# Altium schematic sheet Debug.SchDoc: DEBUG PORTS
size A4; SheetNumber: 7; SheetTotal: 7; DOC_NO_SCH_DWG: #022024031506
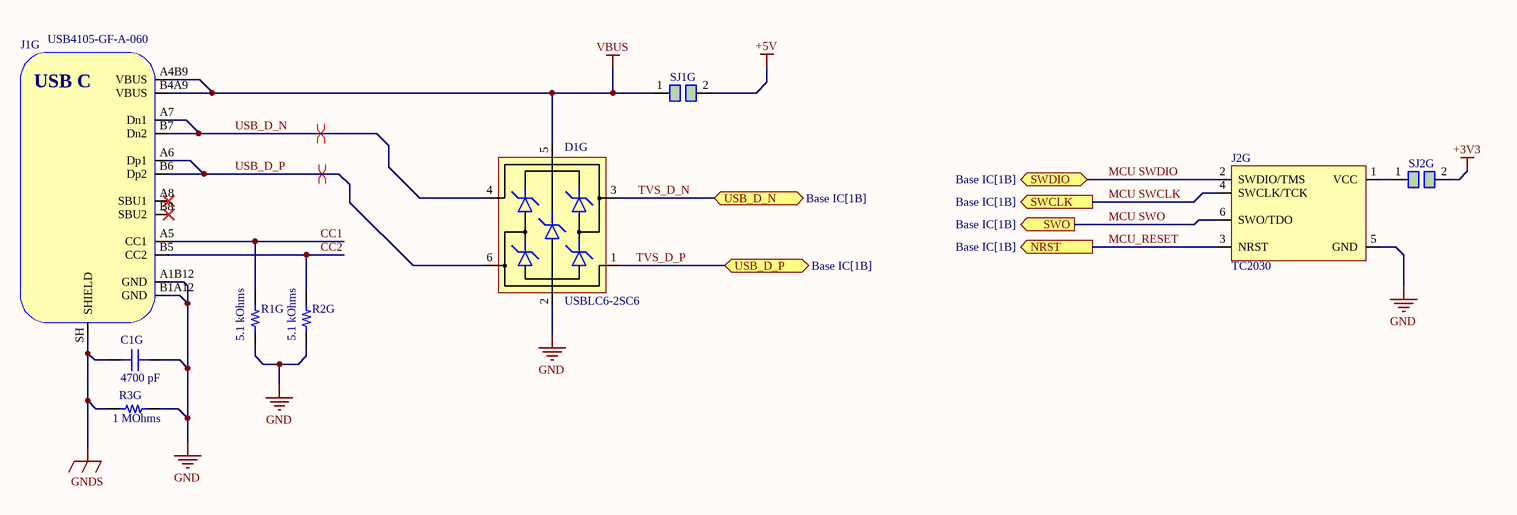
[diagram p0: Debug.SchDoc]

## Parts
C1G  4700 pF  [CAP 0402_1005]
D1G  USBLC6-2SC6  [SOT-23-6]
J1G  USB4105-GF-A-060  [USB4105-GF-A-060]
J2G  TC2030  [TC2030-FP]  (no BOM)
R1G  5.1 kOhms  [RES 0402_1005]
R2G  5.1 kOhms  [RES 0402_1005]
R3G  1 MOhms  [RES 0402_1005]
SJ1G  2PIN  [Rectangular Jumper]  (value not drawn)
SJ2G  2PIN  [Rectangular Jumper]  (value not drawn)

## Ports
NRST (out, see Base IC[1B]), SWCLK (out, see Base IC[1B]), SWDIO (bidir, see Base IC[1B]), SWO (out, see Base IC[1B]), USB_D_N (bidir, see Base IC[1B]), USB_D_P (bidir, see Base IC[1B])

## Nets
+3V3: SJ2G.2
+5V: SJ1G.2
GND: C1G.2 D1G.2(GND) J1G.A1B12(GND) J1G.B1A12(GND) J2G.5(GND) R1G.1 R2G.1 R3G.2
GNDS: C1G.1 J1G.SH(SHIELD) R3G.1
VBUS: D1G.5(VBUS) J1G.A4B9(VBUS) J1G.B4A9(VBUS) SJ1G.1
CC1: J1G.A5(CC1) R1G.2
CC2: J1G.B5(CC2) R2G.2
MCU SWCLK: J2G.4(SWCLK/TCK) ; port SWCLK
MCU SWDIO: J2G.2(SWDIO/TMS) ; port SWDIO
MCU SWO: J2G.6(SWO/TDO) ; port SWO
MCU_RESET: J2G.3(NRST) ; port NRST
TVS_D_N: D1G.3(IO2) ; port USB_D_N
TVS_D_P: D1G.1(IO1) ; port USB_D_P
USB_D_N: D1G.4(IO2) J1G.A7(Dn1) J1G.B7(Dn2)
USB_D_P: D1G.6(IO1) J1G.A6(Dp1) J1G.B6(Dp2)
NetJ2G_1: J2G.1(VCC) SJ2G.1

Not connected (* = marked no-connect by the designer): J1G A8(SBU1)* B8(SBU2)*

## Layout directives
differential pair: USB_D_N, USB_D_P

## Notes on the sheet
- THIS DOCUMENT AND THE DATA DISCLOSED HEREIN OR
- HEREWITH IS THE PROPERTY OF SPD Ind.
- ENG:
- DHARAGESWARAN S
- APPROVALS
- DATE
- PROJECT
- DSN:
- CHK:
- REFERENCE DOCUMENTS
- PROJECT REVISION:
- TITLE
- DOCUMENT REVISION:
- Email: sdhamuvkl@gmail.com <https://github.com/DhamuVkl>
- BOM:
- FAB DWG:
- PCB DWG:
- ASSY DWG:
- SCALE:
- A4
- SIZE
- CAGE CODE
- FILE NAME
- DWG NO.
- SHEET
- REV
- OF
- (in symbol USB4105-GF-A-060) USB C

## Library data of the parts
C1G = C0402C472K4RECAUTO: CAP CER 0402 4.7NF 16V X7R 10%; Manufacturer: KEMET; id: 3032; Part Number: C0402C472K4RECAUTO; Value: 4700 pF; Temperature Coefficient: X7R; Supplier Part Number 1: 399-17875-1-ND; ComponentLink2Description: DigiKey Link; ComponentLink1URL: https://api.kemet.com/component-edge/download/datasheet/C0402C472K4RECAUTO.pdf; PartId: 12122; Tolerance: ±10%; Supplier 1: DigiKey; Series: ESD SMD Auto X7R; LastUpdated: 2023-01-03T20:03:46.940; Part Status: Active; Capacitance: 4700 pF; Device Package: 0402 (1005 Metric); Ratings: AEC-Q200; Thickness (Max): 0.022" (0.55mm); Voltage - Rated: 16V; Minimum Order: 1; Packaging: TapeAndReel; Applications: Automotive, ESD Protection; Package / Case: 0402 (1005 Metric); ComponentLink1Description: Datasheet; Price: 0.01; ComponentLink2URL: https://www.digikey.com/en/products/detail/kemet/C0402C472K4RECAUTO/8640469; Lifecycle Status: Active; Operating Temperature: -55°C ~ 125°C; Size / Dimension: 0.039" L x 0.020" W (1.00mm x 0.50mm); Mounting Type: Surface Mount, MLCC
D1G = USBLC6-2SC6: Low-Capacitance ESD Protection USB; Manufacturer: STMicroelectronics; Manufacturer Part Number: USBLC6-2SC6; Distributor Link: https://www.mouser.de/ProductDetail/STMicroelectronics/USBLC6-2SC6?qs=po45yt2pPpu%2FhNIlwQdTlg%3D%3D
J1G = USB4105-GF-A-060: USB Connector Type C SMT 12 Pin; Manufacturer: GCT; Manufacturer Part Number: USB4105-GF-A-060; Distributor Link: https://eu.mouser.com/ProductDetail/GCT/USB4105-GF-A-060?qs=QNEnbhJQKvY2mocwNJzgfA%3D%3D
J2G = TC2030: Tag-Connect No-Solder SWD Debug Connector DO NOT PLACE; Manufacturer: Tag-Connect; Manufacturer Part Number: TC2030; Supplier 1: Digikey; Supplier Part Number 1: TC2030-MCP-NLTC-ND
R1G R2G = AC0402FR-075K1L: RES SMD 5.1K OHM 1% 1/16W 0402; Manufacturer: Yageo; id: 5028; Temperature Coefficient: ±100ppm/°C; Power (Watts): 0.063W, 1/16W; Part Number: AC0402FR-075K1L; Height - Seated (Max): 0.015" (0.37mm); Supplier Part Number 1: YAG3503CT-ND; Supplier Device Package: 0402; ComponentLink1Description: Datasheet; ComponentLink2URL: https://www.digikey.com/en/products/detail/yageo/AC0402FR-075K1L/5895438; Features: Automotive AEC-Q200, Moisture Resistant; ComponentLink1URL: https://www.yageo.com/upload/media/product/productsearch/datasheet/rchip/PYu-AC_51_RoHS_L_7.pdf; Composition: Thick Film; Tolerance: ±1%; Supplier 1: DigiKey; Series: AC; Part Status: Active; ComponentLink2Description: DigiKey Link; Device Package: 0402 (1005 Metric); Packaging: CutTape; Ratings: AEC-Q200; Minimum Order: 1; Package / Case: 0402 (1005 Metric); PartId: 12111; Lifecycle Status: Active; LastUpdated: 2023-01-02T20:21:09.567; Operating Temperature: -55°C ~ 155°C; Number Of Terminations: 2; Value: 5.1 kOhms; Size / Dimension: 0.039" L x 0.020" W (1.00mm x 0.50mm); Price: 0.01; Resistance: 5.1 kOhms
R3G = AC0402FR-071ML: RES SMD 1M OHM 1% 1/16W 0402; Manufacturer: Yageo; id: 4991; Temperature Coefficient: ±100ppm/°C; Power (Watts): 0.063W, 1/16W; Part Number: AC0402FR-071ML; Height - Seated (Max): 0.015" (0.37mm); Supplier Part Number 1: YAG3450CT-ND; Supplier Device Package: 0402; ComponentLink1Description: Datasheet; ComponentLink2URL: https://www.digikey.com/en/products/detail/yageo/AC0402FR-071ML/5895164; Features: Automotive AEC-Q200, Moisture Resistant; ComponentLink1URL: https://www.yageo.com/upload/media/product/productsearch/datasheet/rchip/PYu-AC_51_RoHS_L_7.pdf; Composition: Thick Film; Tolerance: ±1%; Supplier 1: DigiKey; Series: AC; Part Status: Active; ComponentLink2Description: DigiKey Link; Device Package: 0402 (1005 Metric); Packaging: CutTape; Ratings: AEC-Q200; Minimum Order: 1; Package / Case: 0402 (1005 Metric); PartId: 12043; Lifecycle Status: Active; LastUpdated: 2023-01-02T20:21:09.883; Operating Temperature: -55°C ~ 155°C; Number Of Terminations: 2; Value: 1 MOhms; Size / Dimension: 0.039" L x 0.020" W (1.00mm x 0.50mm); Price: 0.01; Resistance: 1 MOhms
SJ1G SJ2G = Regtangular Jumper